# EAGLE design onboard (EAGLE 9.5.1)
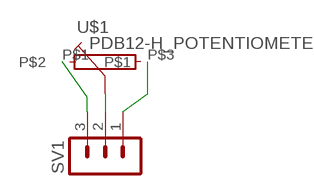
[diagram p0: schematic, sheet 1]

## Parts
SV1  MA03-1  [MA03-1]
U$1  PDB12-H_POTENTIOMETER  [PBD12-H]

## Nets
N$1: SV1.3 U$1.P$1
N$2: SV1.2 U$1.P$2
N$3: SV1.1 U$1.P$3

## Library data of the parts
SV1 = con-lstb:MA03-1: PIN HEADER; OC_FARNELL: unknown; OC_NEWARK: unknown
U$1 = PDB12-H_Potentiometer:PDB12-H_POTENTIOMETER

## Board
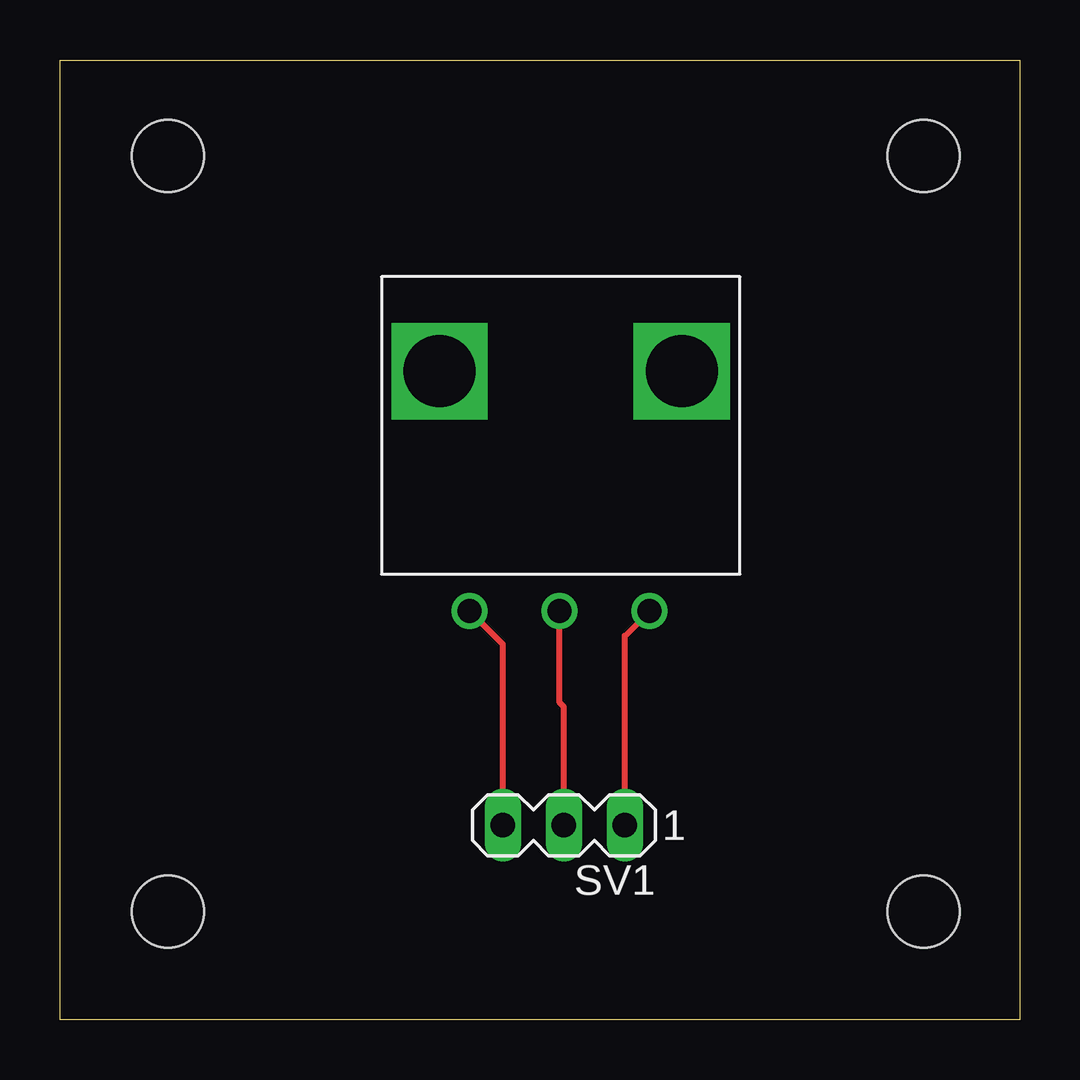
[diagram p1: board, top side]

Size 40 x 40 mm. Coordinates in mm from the lower left corner, seen from the top.
Outline: 0,0 0,40 40,40 40,0 0,0
Copper layers (1*16): Top 0.035mm / dielectric 1.5mm / Bottom 0.035mm
Design rules "default": minimum track width 6mil, minimum drill 0.35mm, track to track 6mil, track to pad 6mil, pad to pad 6mil, via to via 6mil, smd to smd 6mil, copper to edge 40mil, drill to drill 6mil, minimum pad ring 10mil, minimum via ring 8mil, stop-mask expansion 4mil, vias tented up to drill 0mil, thermal gap 10mil
Holes 3 mm at 4.5,36 36,36 36,4.5 4.5,4.5

### Footprints (pad centres in the part's own frame; a part is rotated, then mirrored left to right if it is on the bottom)
MA03-1 = drill 1.016 long: 1 -2.54,0; 2 0,0; 3 2.54,0
PBD12-H = drill 1: P$1 -3.83,-7.89; P$2 -0.08,-7.89; P$3 3.67,-7.89 | drill 3 square: P$4 -5.08,2.11; P$5 5.02,2.11

### Placement (x,y rotation side)
SV1  21.01,8.1 180 top
U$1  20.9,24.92 0 top

### Tracks (layer width: path | path; a pad name or v marks a point on that pad's centre or on a via)
N$1
  Top 0.254: U$1.P$1 18.47,15.64 18.47,11.43 SV1.3
N$2
  Top 0.254: SV1.2 21.01,13.04 20.82,13.22 U$1.P$2
N$3
  Top 0.254: SV1.1 23.55,16 U$1.P$3